# Altium schematic sheet analog_gpio.SchDoc
size 701 x 447 mm
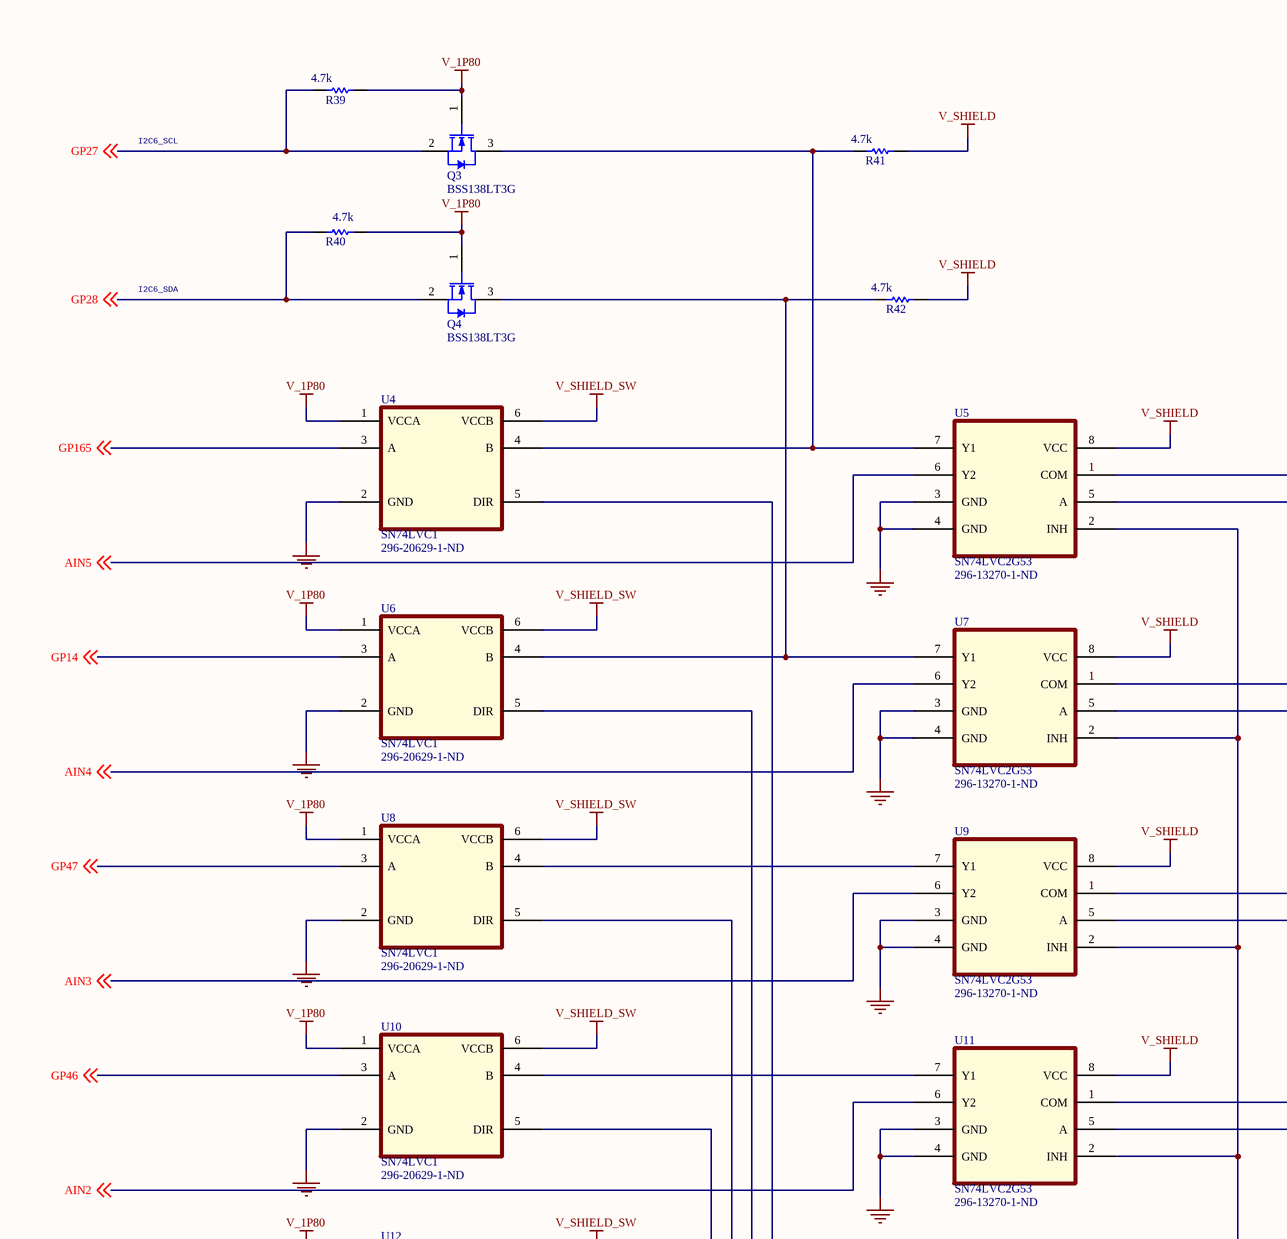
[diagram p0: analog_gpio.SchDoc, top left]
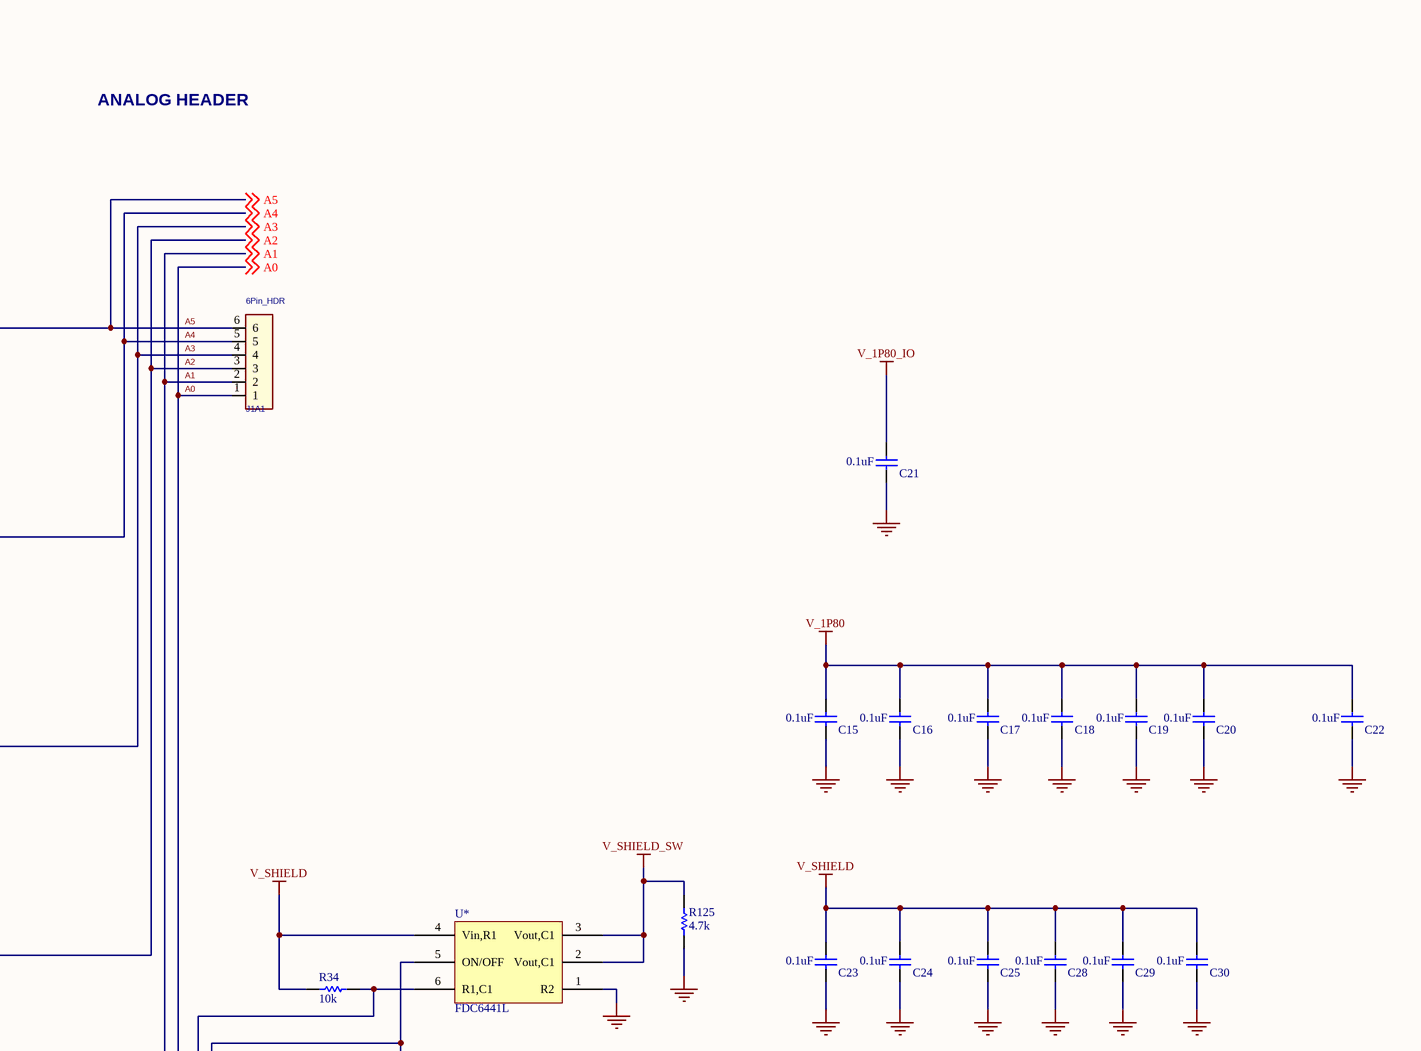
[diagram p1: analog_gpio.SchDoc, top right]
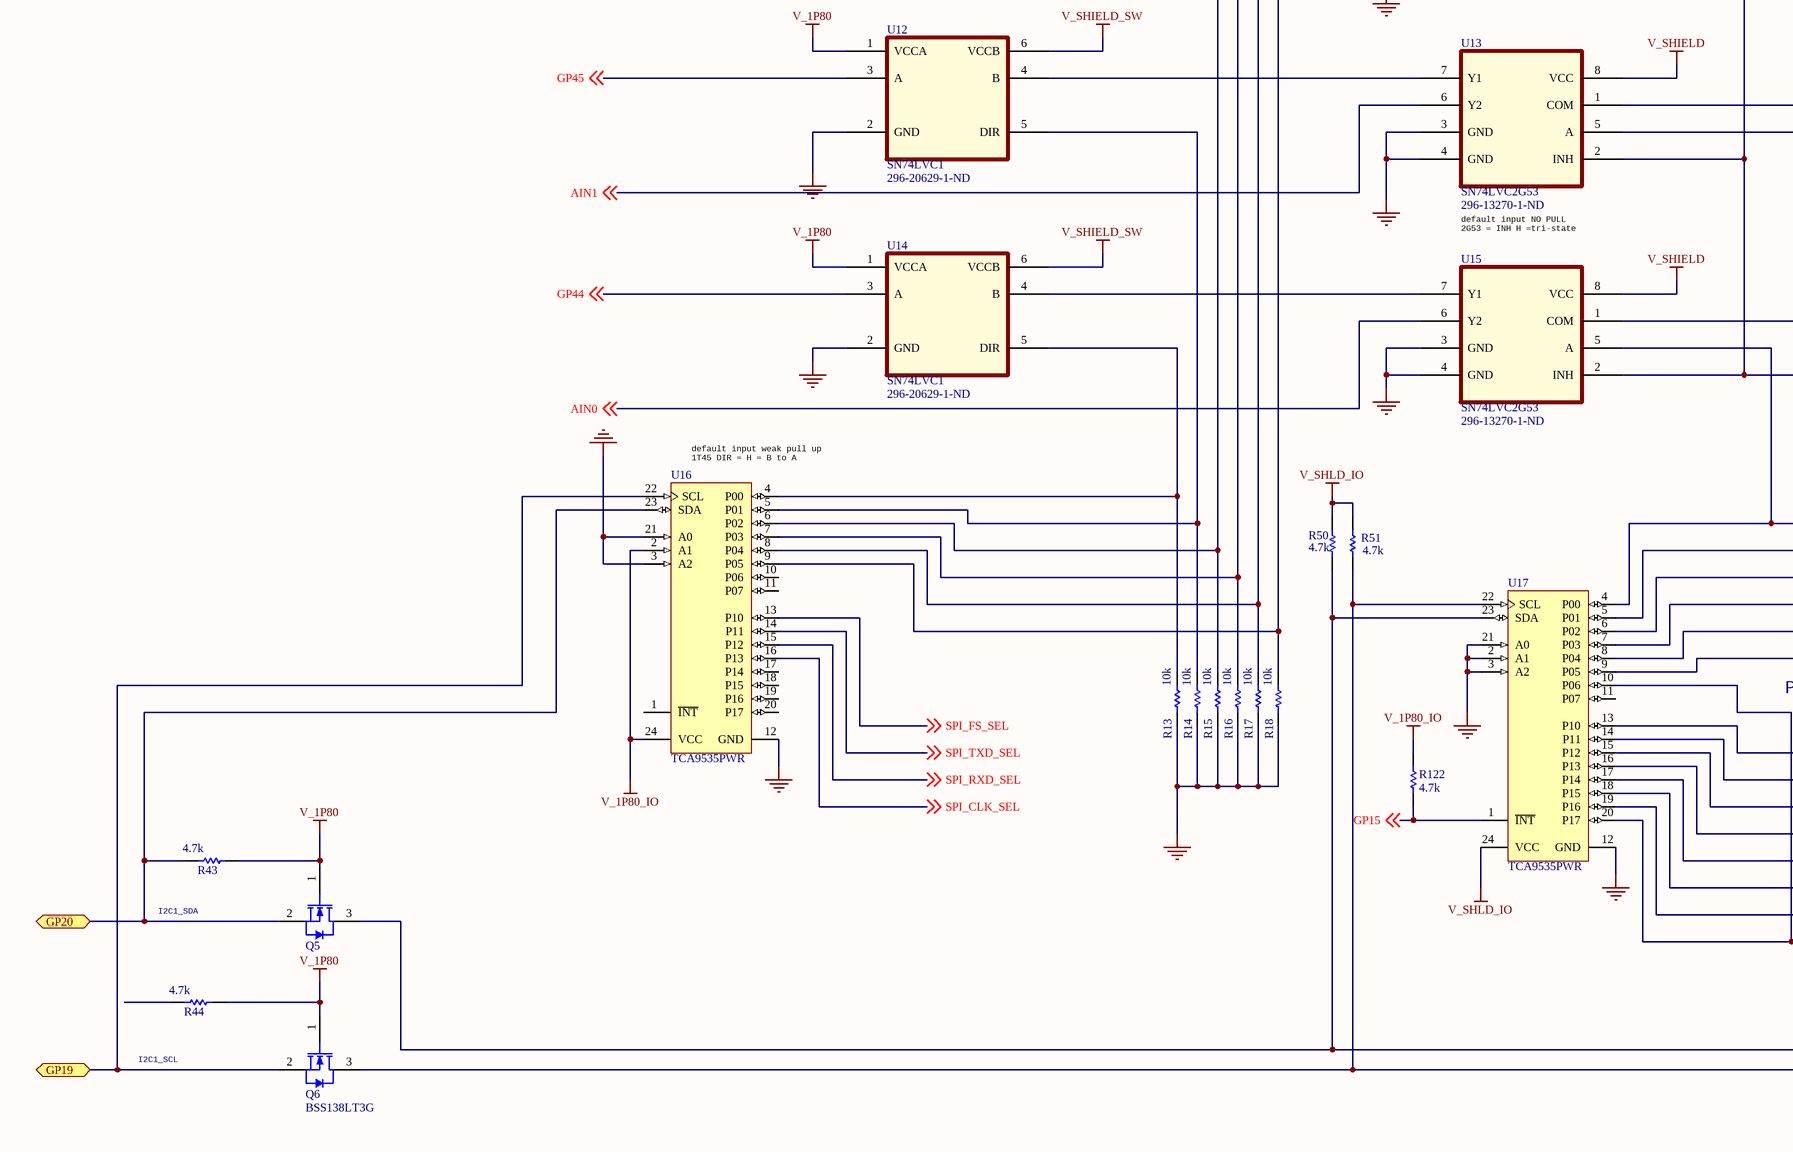
[diagram p2: analog_gpio.SchDoc, bottom left]
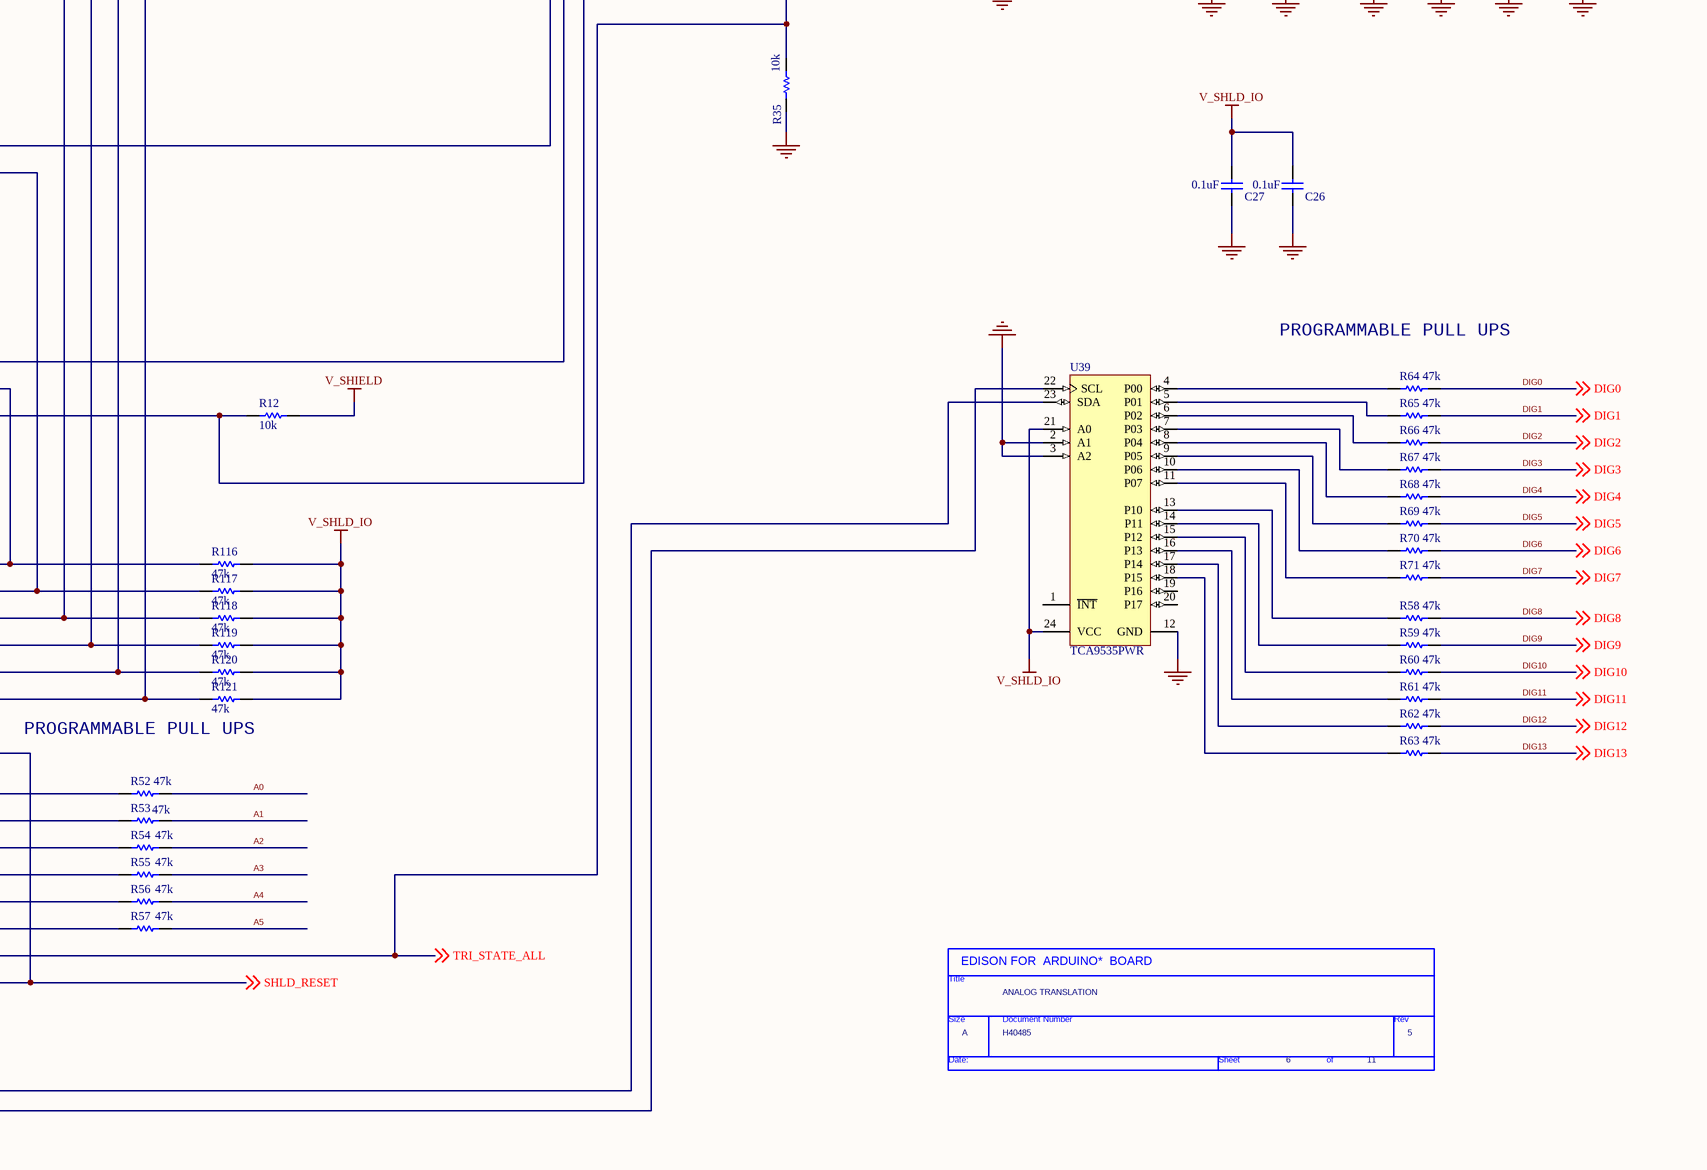
[diagram p3: analog_gpio.SchDoc, bottom right]

## Parts
*  Page Count: 11  Page Number: 6  Page Size: A  Title: ANALOG TRANSLATION  RevCode: 5  Doc: H40485  (hidden comment: TitleBlock0)  (graphical)
C15  value 0.1uF  [CAPC0201(0603)33_L]  (hidden comment: CAP 1.5nF 10V 0201(0603))
C16  value 0.1uF  [CAPC0201(0603)33_L]  (hidden comment: CAP 1.5nF 10V 0201(0603))
C17  value 0.1uF  [CAPC0201(0603)33_L]  (hidden comment: CAP 1.5nF 10V 0201(0603))
C18  value 0.1uF  [CAPC0201(0603)33_L]  (hidden comment: CAP 1.5nF 10V 0201(0603))
C19  value 0.1uF  [CAPC0201(0603)33_L]  (hidden comment: CAP 1.5nF 10V 0201(0603))
C20  value 0.1uF  [CAPC0201(0603)33_L]  (hidden comment: CAP 1.5nF 10V 0201(0603))
C21  value 0.1uF  [CAPC0201(0603)33_L]  (hidden comment: CAP 1.5nF 10V 0201(0603))
C22  value 0.1uF  [CAPC0201(0603)33_L]  (hidden comment: CAP 1.5nF 10V 0201(0603))
C23  value 0.1uF  [CAPC0201(0603)33_L]  (hidden comment: CAP 1.5nF 10V 0201(0603))
C24  value 0.1uF  [CAPC0201(0603)33_L]  (hidden comment: CAP 1.5nF 10V 0201(0603))
C25  value 0.1uF  [CAPC0201(0603)33_L]  (hidden comment: CAP 1.5nF 10V 0201(0603))
C26  value 0.1uF  [CAPC0201(0603)33_L]  (hidden comment: CAP 1.5nF 10V 0201(0603))
C27  value 0.1uF  [CAPC0201(0603)33_L]  (hidden comment: CAP 1.5nF 10V 0201(0603))
C28  value 0.1uF  [CAPC0201(0603)33_L]  (hidden comment: CAP 1.5nF 10V 0201(0603))
C29  value 0.1uF  [CAPC0201(0603)33_L]  (hidden comment: CAP 1.5nF 10V 0201(0603))
C30  value 0.1uF  [CAPC0201(0603)33_L]  (hidden comment: CAP 1.5nF 10V 0201(0603))
J1A1  6Pin_HDR  [109728-038]
Q3  BSS138LT3G  [ONSC-SOT-23-3-318-08_V]
Q4  BSS138LT3G  [ONSC-SOT-23-3-318-08_V]
Q5  BSS138LT3G  [ONSC-SOT-23-3-318-08_V]  (value not drawn)
Q6  BSS138LT3G  [ONSC-SOT-23-3-318-08_V]
R12  value 10k  [RESC0201(0603)_M]  (hidden comment: 165R 1% 0201(0603))
R13  value 10k  [RESC0201(0603)_M]  (hidden comment: 165R 1% 0201(0603))
R14  value 10k  [RESC0201(0603)_M]  (hidden comment: 165R 1% 0201(0603))
R15  value 10k  [RESC0201(0603)_M]  (hidden comment: 165R 1% 0201(0603))
R16  value 10k  [RESC0201(0603)_M]  (hidden comment: 165R 1% 0201(0603))
R17  value 10k  [RESC0201(0603)_M]  (hidden comment: 165R 1% 0201(0603))
R18  value 10k  [RESC0201(0603)_M]  (hidden comment: 165R 1% 0201(0603))
R34  value 10k  [RESC0201(0603)_M]  (hidden comment: 165R 1% 0201(0603))
R35  value 10k  [RESC0201(0603)_M]  (hidden comment: 165R 1% 0201(0603))
R39  value 4.7k  [RESC0201(0603)_M]  (hidden comment: 4K7 1% 0201(0603))
R40  value 4.7k  [RESC0201(0603)_M]  (hidden comment: 4K7 1% 0201(0603))
R41  value 4.7k  [RESC0201(0603)_M]  (hidden comment: 4K7 1% 0201(0603))
R42  value 4.7k  [RESC0201(0603)_M]  (hidden comment: 4K7 1% 0201(0603))
R43  value 4.7k  [RESC0201(0603)_M]  (hidden comment: 4K7 1% 0201(0603))
R44  value 4.7k  [RESC0201(0603)_M]  (hidden comment: 4K7 1% 0201(0603))
R50  value 4.7k  [RESC0201(0603)_M]  (hidden comment: 4K7 1% 0201(0603))
R51  value 4.7k  [RESC0201(0603)_M]  (hidden comment: 4K7 1% 0201(0603))
R52  value 47k  [RESC0201(0603)_N]  (hidden comment: 47K 1% 0201(0603))
R53  value 47k  [RESC0201(0603)_N]  (hidden comment: 47K 1% 0201(0603))
R54  value 47k  [RESC0201(0603)_N]  (hidden comment: 47K 1% 0201(0603))
R55  value 47k  [RESC0201(0603)_N]  (hidden comment: 47K 1% 0201(0603))
R56  value 47k  [RESC0201(0603)_N]  (hidden comment: 47K 1% 0201(0603))
R57  value 47k  [RESC0201(0603)_N]  (hidden comment: 47K 1% 0201(0603))
R58  value 47k  [RESC0201(0603)_N]  (hidden comment: 47K 1% 0201(0603))
R59  value 47k  [RESC0201(0603)_N]  (hidden comment: 47K 1% 0201(0603))
R60  value 47k  [RESC0201(0603)_N]  (hidden comment: 47K 1% 0201(0603))
R61  value 47k  [RESC0201(0603)_N]  (hidden comment: 47K 1% 0201(0603))
R62  value 47k  [RESC0201(0603)_N]  (hidden comment: 47K 1% 0201(0603))
R63  value 47k  [RESC0201(0603)_N]  (hidden comment: 47K 1% 0201(0603))
R64  value 47k  [RESC0201(0603)_N]  (hidden comment: 47K 1% 0201(0603))
R65  value 47k  [RESC0201(0603)_N]  (hidden comment: 47K 1% 0201(0603))
R66  value 47k  [RESC0201(0603)_N]  (hidden comment: 47K 1% 0201(0603))
R67  value 47k  [RESC0201(0603)_N]  (hidden comment: 47K 1% 0201(0603))
R68  value 47k  [RESC0201(0603)_N]  (hidden comment: 47K 1% 0201(0603))
R69  value 47k  [RESC0201(0603)_N]  (hidden comment: 47K 1% 0201(0603))
R70  value 47k  [RESC0201(0603)_N]  (hidden comment: 47K 1% 0201(0603))
R71  value 47k  [RESC0201(0603)_N]  (hidden comment: 47K 1% 0201(0603))
R116  value 47k  [RESC0201(0603)_N]  (hidden comment: 47K 1% 0201(0603))
R117  value 47k  [RESC0201(0603)_N]  (hidden comment: 47K 1% 0201(0603))
R118  value 47k  [RESC0201(0603)_N]  (hidden comment: 47K 1% 0201(0603))
R119  value 47k  [RESC0201(0603)_N]  (hidden comment: 47K 1% 0201(0603))
R120  value 47k  [RESC0201(0603)_N]  (hidden comment: 47K 1% 0201(0603))
R121  value 47k  [RESC0201(0603)_N]  (hidden comment: 47K 1% 0201(0603))
R122  value 4.7k  [RESC0201(0603)_M]  (hidden comment: 4K7 1% 0201(0603))
R125  value 4.7k  [RESC0201(0603)_M]  (hidden comment: 4K7 1% 0201(0603))
U4  SN74LVC1  Supplier Part Number 1: 296-20629-1-ND  [R-PDSO-N6]
U5  SN74LVC2G53  Supplier Part Number 1: 296-13270-1-ND  [S-PSDO-8]
U6  SN74LVC1  Supplier Part Number 1: 296-20629-1-ND  [R-PDSO-N6]
U7  SN74LVC2G53  Supplier Part Number 1: 296-13270-1-ND  [S-PSDO-8]
U8  SN74LVC1  Supplier Part Number 1: 296-20629-1-ND  [R-PDSO-N6]
U9  SN74LVC2G53  Supplier Part Number 1: 296-13270-1-ND  [S-PSDO-8]
U10  SN74LVC1  Supplier Part Number 1: 296-20629-1-ND  [R-PDSO-N6]
U11  SN74LVC2G53  Supplier Part Number 1: 296-13270-1-ND  [S-PSDO-8]
U12  SN74LVC1  Supplier Part Number 1: 296-20629-1-ND  [R-PDSO-N6]
U13  SN74LVC2G53  Supplier Part Number 1: 296-13270-1-ND  [S-PSDO-8]
U14  SN74LVC1  Supplier Part Number 1: 296-20629-1-ND  [R-PDSO-N6]
U15  SN74LVC2G53  Supplier Part Number 1: 296-13270-1-ND  [S-PSDO-8]
U16  TCA9535PWR  [PW24_N]
U17  TCA9535PWR  [PW24_N]
U39  TCA9535PWR  [PW24_N]
U*  FDC6441L  [SUPERSOP6]

## Ports
GP19 (bidir), GP20 (bidir)

## Nets
GND: C15.1 C16.1 C17.1 C18.1 C19.1 C20.1 C21.1 C22.1 C23.1 C24.1 C25.1 C26.1 C27.1 C28.1 C29.1 C30.1 R13.2 R14.2 R15.2 R16.2 R17.2 R18.2 R35.2 R125.2 U4.2(GND) U5.3(GND) U5.4(GND) U6.2(GND) U7.3(GND) U7.4(GND) U8.2(GND) U9.3(GND) U9.4(GND) U10.2(GND) U11.3(GND) U11.4(GND) U12.2(GND) U13.3(GND) U13.4(GND) U14.2(GND) U15.3(GND) U15.4(GND) U16.3(A2) U16.12(GND) U16.21(A0) U17.2(A1) U17.3(A2) U17.12(GND) U17.21(A0) U39.2(A1) U39.3(A2) U39.12(GND) U*.1(R2)
V_1P80: C15.2 C16.2 C17.2 C18.2 C19.2 C20.2 C22.2 Q3.1(G) Q4.1(G) Q5.1(G) Q6.1(G) R39.1 R40.1 R43.1 R44.1 U4.1(VCCA) U6.1(VCCA) U8.1(VCCA) U10.1(VCCA) U12.1(VCCA) U14.1(VCCA)
V_1P80_IO: C21.2 R122.1 U16.2(A1) U16.24(VCC)
V_SHIELD: C23.2 C24.2 C25.2 C28.2 C29.2 C30.2 R12.2 R34.1 R41.1 R42.1 U5.8(VCC) U7.8(VCC) U9.8(VCC) U11.8(VCC) U13.8(VCC) U15.8(VCC) U*.4(Vin,R1)
V_SHIELD_SW: R125.1 U4.6(VCCB) U6.6(VCCB) U8.6(VCCB) U10.6(VCCB) U12.6(VCCB) U14.6(VCCB) U*.2(Vout,C1) U*.3(Vout,C1)
V_SHLD_IO: C26.2 C27.2 R50.1 R51.1 R116.1 R117.1 R118.1 R119.1 R120.1 R121.1 U17.24(VCC) U39.21(A0) U39.24(VCC)
A0: J1A1.1 R52.1 U15.1(COM) ; off-sheet A0
A1: J1A1.2 R53.1 U13.1(COM) ; off-sheet A1
A2: J1A1.3 R54.1 U11.1(COM) ; off-sheet A2
A3: J1A1.4 R55.1 U9.1(COM) ; off-sheet A3
A4: J1A1.5 R56.1 U7.1(COM) ; off-sheet A4
A5: J1A1.6 R57.1 U5.1(COM) ; off-sheet A5
AIN0: U15.6(Y2) ; off-sheet AIN0
AIN1: U13.6(Y2) ; off-sheet AIN1
AIN2: U11.6(Y2) ; off-sheet AIN2
AIN3: U9.6(Y2) ; off-sheet AIN3
AIN4: U7.6(Y2) ; off-sheet AIN4
AIN5: U5.6(Y2) ; off-sheet AIN5
DIG0: R64.1 ; off-sheet DIG0
DIG1: R65.1 ; off-sheet DIG1
DIG2: R66.1 ; off-sheet DIG2
DIG3: R67.1 ; off-sheet DIG3
DIG4: R68.1 ; off-sheet DIG4
DIG5: R69.1 ; off-sheet DIG5
DIG6: R70.1 ; off-sheet DIG6
DIG7: R71.1 ; off-sheet DIG7
DIG8: R58.1 ; off-sheet DIG8
DIG9: R59.1 ; off-sheet DIG9
DIG10: R60.1 ; off-sheet DIG10
DIG11: R61.1 ; off-sheet DIG11
DIG12: R62.1 ; off-sheet DIG12
DIG13: R63.1 ; off-sheet DIG13
GP14: U6.3(A) ; off-sheet GP14
GP15: R122.2 U17.1(~{INT}) ; off-sheet GP15
GP19: Q6.2(S) U16.22(SCL) ; port GP19
GP20: Q5.2(S) R43.2 U16.23(SDA) ; port GP20
GP27: Q3.2(S) R39.2 ; off-sheet GP27
GP28: Q4.2(S) R40.2 ; off-sheet GP28
GP44: U14.3(A) ; off-sheet GP44
GP45: U12.3(A) ; off-sheet GP45
GP46: U10.3(A) ; off-sheet GP46
GP47: U8.3(A) ; off-sheet GP47
GP165: U4.3(A) ; off-sheet GP165
SHLD_RESET: U17.10(P06) U17.20(P17) ; off-sheet SHLD_RESET
SPI_CLK_SEL: U16.16(P13) ; off-sheet SPI_CLK_SEL
SPI_FS_SEL: U16.13(P10) ; off-sheet SPI_FS_SEL
SPI_RXD_SEL: U16.15(P12) ; off-sheet SPI_RXD_SEL
SPI_TXD_SEL: U16.14(P11) ; off-sheet SPI_TXD_SEL
TRI_STATE_ALL: R35.1 U17.19(P16) U*.5(ON/OFF) ; off-sheet TRI_STATE_ALL
NetQ3_3: Q3.3(D) R41.2 U4.4(B) U5.7(Y1)
NetQ4_3: Q4.3(D) R42.2 U6.4(B) U7.7(Y1)
NetQ5_3: Q5.3(D) R50.2 U17.23(SDA) U39.23(SDA)
NetQ6_3: Q6.3(D) R51.2 U17.22(SCL) U39.22(SCL)
NetR12_1: R12.1 R34.2 U5.2(INH) U7.2(INH) U9.2(INH) U11.2(INH) U13.2(INH) U15.2(INH) U*.6(R1,C1)
NetR13_1: R13.1 U14.5(DIR) U16.4(P00)
NetR14_1: R14.1 U12.5(DIR) U16.5(P01)
NetR15_1: R15.1 U10.5(DIR) U16.6(P02)
NetR16_1: R16.1 U8.5(DIR) U16.7(P03)
NetR17_1: R17.1 U6.5(DIR) U16.8(P04)
NetR18_1: R18.1 U4.5(DIR) U16.9(P05)
NetR52_2: R52.2 U17.13(P10)
NetR53_2: R53.2 U17.14(P11)
NetR54_2: R54.2 U17.15(P12)
NetR55_2: R55.2 U17.16(P13)
NetR56_2: R56.2 U17.17(P14)
NetR57_2: R57.2 U17.18(P15)
NetR58_2: R58.2 U39.13(P10)
NetR59_2: R59.2 U39.14(P11)
NetR60_2: R60.2 U39.15(P12)
NetR61_2: R61.2 U39.16(P13)
NetR62_2: R62.2 U39.17(P14)
NetR63_2: R63.2 U39.18(P15)
NetR64_2: R64.2 U39.4(P00)
NetR65_2: R65.2 U39.5(P01)
NetR66_2: R66.2 U39.6(P02)
NetR67_2: R67.2 U39.7(P03)
NetR68_2: R68.2 U39.8(P04)
NetR69_2: R69.2 U39.9(P05)
NetR70_2: R70.2 U39.10(P06)
NetR71_2: R71.2 U39.11(P07)
NetR116_2: R116.2 U15.5(A) U17.4(P00)
NetR117_2: R117.2 U13.5(A) U17.5(P01)
NetR118_2: R118.2 U11.5(A) U17.6(P02)
NetR119_2: R119.2 U9.5(A) U17.7(P03)
NetR120_2: R120.2 U7.5(A) U17.8(P04)
NetR121_2: R121.2 U5.5(A) U17.9(P05)
NetU8_4: U8.4(B) U9.7(Y1)
NetU10_4: U10.4(B) U11.7(Y1)
NetU12_4: U12.4(B) U13.7(Y1)
NetU14_4: U14.4(B) U15.7(Y1)

Not connected (* = marked no-connect by the designer): R44 2; U16 1(~{INT}) 10(P06) 11(P07) 17(P14) 18(P15) 19(P16) 20(P17); U17 11(P07); U39 1(~{INT}) 19(P16) 20(P17)

## Notes on the sheet
- I2C6_SCL
- I2C6_SDA
- ANALOG HEADER
- default input NO PULL
  2G53 = INH H =tri-state
- PROGRAMMABLE PULL UPS
- (near U16) default input weak pull up
  1T45 DIR = H = B to A
- (near R121) PROGRAMMABLE PULL UPS
- (near R43) I2C1_SDA
- I2C1_SCL
- (in symbol TitleBlock0) EDISON FOR  ARDUINO*  BOARD; Title; Size; Document Number; Rev; Date:; Sheet; of

## Library data of the parts
C15-C30 = CMP-1033-00601-1: CAP 1.5nF 10V ±20% 0201 (0603 Metric) Thickness 0.33mm SMD; Case-Metric: 0603; Case-EIA: 0201; Rated Voltage: 10 V; Technology: SMT; Tolerance: ±20%; Max Thickness: 0.33 mm; Supplier 1: Digi-Key; Supplier Part Number 1: 1276-1115-1-ND
J1A1 = CON6,HDR,TH,0.1in,C77962-001: CONN,PLUG,VERT,1X6,2.54MM,THM,90147_1106; NO_STUFF: .; RATING: 1Amax; DEVICE: H46111-001; LEAD_FREE: YES; BOM: x; ROOM: NO_ROOM; IPN: H46111-001; PART_NUMBER: H46111-001; FINANCE: x
Q3-Q6 = CMP-1058-00765-1: Power MOSFET, 200 mA, 50 V, N-Channel, 3-Pin SOT-23, Pb-Free, Tape and Reel; Manufacturer: On Semiconductor; PD Max (W): 0.225; Channel Polarity: N Channel; Crss Typ (pF): 3.5; Configuration: Single; ID Max (A): 0.2; Ciss Typ (pF): 40; V(BR)DSS Min (V): 50; VGS(th) Max (V): 1.5; Coss Typ (pF): 12; VGS Max (V): 20; ComponentLink2URL: http://www.onsemi.com/pub_link/Collateral/BSS138LT1-D.PDF; PackageDescription: 3-Pin Small Outline Transistor, Body 2.92 x 1.3 mm, Pitch 0.95 mm; Package Type: SOT-23-3; Mounting Technology: Surface Mount; ComponentLink1Description: Manufacturer URL; PackageVersion: Rev. AP, 11/2009; ComponentLink3Description: Package Specification; DatasheetVersion: Rev. 8; RoHS: Pb-Free; Packing: Tape and Reel; PackageReference: SOT-23-3-318-08; PartNumber: BSS138LT3G; ComponentLink3URL: http://www.onsemi.cn/pub_link/Collateral/318-08.PDF; ComponentLink1URL: http://www.onsemi.com/; ComponentLink2Description: Datasheet
R12-R18 R34 R35 = CMP-1010-00326-1: 165R 0.05W 1% 0201 (0603 Metric)  SMD; Case-EIA: 0201; Case-Metric: 0603; Power: 0.05 W; Tolerance: 1 %; Technology: SMT; Supplier 1: Digi-Key; Supplier Part Number 1: 311-165HRCT-ND
R39-R44 R50 R51 R122 R125 = CMP-1010-00492-1: 4K7 0.05W 1% 0201 (0603 Metric)  SMD; Case-Metric: 0603; Case-EIA: 0201; Technology: SMT; Tolerance: 1 %; Power: 0.05 W; Supplier 1: Digi-Key; Supplier Part Number 1: 311-4.7KNCT-ND
R52-R71 R116-R121 = CMP-1010-00605-1: 47K 0.05W 1% 0201 (0603 Metric)  SMD; Case-EIA: 0201; Case-Metric: 0603; Technology: SMT; Tolerance: 1 %; Power: 0.05 W; Supplier 1: Digi-Key; Supplier Part Number 1: 311-47KMCT-ND
U16 U17 U39 = CMP-0314-00245-1: Remote 16-Bit I2C and SMBus, Low-Power I/O Expander with Interrupt Output and Config Register, 1.65 to 5.5 V, -40 to 85 degC, 24-pin TSSOP (PW), Green (RoHS & no Sb/Br); Manufacturer: Texas Instruments; SubFamily: I2C IO Expander; Configuration Registers: Yes; Max Frequency(kHz): 400; # of I/Os: 16; I2C Address: 0100 xxx; Code_JEDEC: MO-153; Vcc range(V): 1.65 to 5.5; PackageReference: PW24; ComponentLink2Description: Package Specification; ComponentLink1Description: Datasheet; PartNumber: TCA9535PWR; PackageVersion: revG, Feb-2011; Interrupt Output: Yes; ComponentLink2URL: http://www.ti.com/litv/pdf/mpds177g; Eco-Plan: Green (RoHS & no Sb/Br); ComponentLink1URL: http://www.ti.com/general/docs/lit/getliterature.tsp?genericPartNumber=TCA9535&fileType=pdf; Low Power: Yes; PackageDescription: 24-Pin Thin Small Outline Package 0.65 mm Pitch; DatasheetVersion: SCPS201A; Push-Pull I/O Type: Yes; Mounting Technology: Surface Mount; 5V Tolerant I/O: Yes
U* = FDC6331L: Load Switch; Supplier 1: Digi-Key; Supplier Part Number 1: FDC6331LCT-ND
* = TitleBlock0: Page Create Date: March  8, 1995
U4 U6 U8 U10 U12 U14 = SN74LVC1: Supplier 1: Digi-Key
U5 U7 U9 U11 U13 U15 = SN74LVC2G53: Supplier 1: Digi-Key